# Altium schematic sheet MIDI.SchDoc
size A4; DocumentNumber: 3; SheetNumber: 3
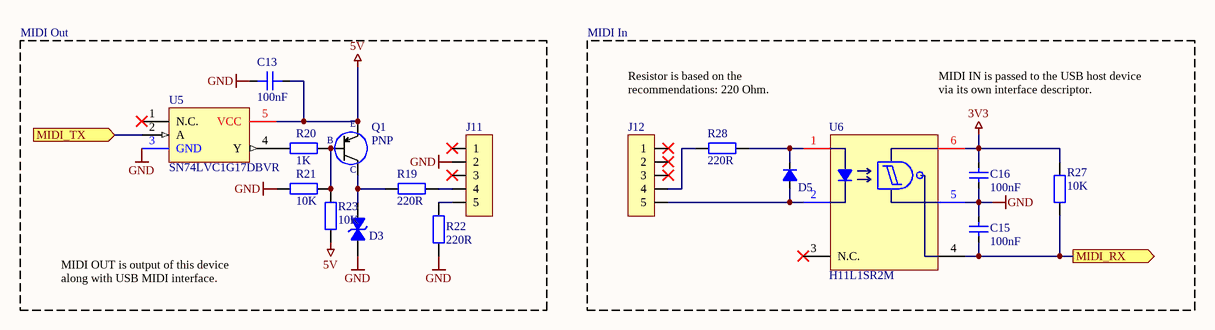
[diagram p0: MIDI.SchDoc]

## Parts
C13  100nF  [0603C_RF_M]
C15  100nF  [0603C_RF_M]
C16  100nF  [0603C_RF_M]
D3  TVS  [NXP_SOD-323_RF_M]  (value not drawn)
D5  D  [NXP_SOD-323_RF_M]  (value not drawn)
J11  PINHDR-5P1  [HEADER-2.54-5P1]  (value not drawn)
J12  PINHDR-5P1  [HEADER-2.54-5P1]  (value not drawn)
Q1  PNP  [SOT-23-3]
R19  220R  [0603R_RF_M]
R20  1K  [0603R_RF_M]
R21  10K  [0603R_RF_M]
R22  220R  [0603R_RF_M]
R23  10K  [0603R_RF_M]
R27  10K  [0603R_RF_M]
R28  220R  [0603R_RF_M]
U5  SN74LVC1G17DBVR  [TI_SOT-23-5]
U6  H11L1SR2M  [H11L1SR2M_SMD-6]

## Blocks framed on the sheet
MIDI Out: C13 D3 J11 Q1 R19-R23 U5
MIDI In: C15 C16 D5 J12 R27 R28 U6

## Ports
MIDI_RX (out), MIDI_TX (in)

## Nets
3V3: C16.2 R27.1 U6.6(VCC)
5V: C13.2 Q1.E(Emmiter) R23.2 U5.5(VCC)
GND: C13.1 C15.2 C16.1 D3.A J11.2 R21.2 R22.1 U5.3(GND) U6.5(GND)
MIDI_RX: C15.1 R27.2 U6.4(OUT) ; port MIDI_RX
MIDI_TX: U5.2(A) ; port MIDI_TX
NetD3_C: D3.C Q1.C(Collector) R19.1
NetD5_A: D5.A J12.5 U6.2(C)
NetD5_C: D5.C R28.2 U6.1(A)
NetJ11_4: J11.4 R19.2
NetJ11_5: J11.5 R22.2
NetJ12_4: J12.4 R28.1
NetQ1_B: Q1.B(Base) R20.1 R21.1 R23.1
NetR20_2: R20.2 U5.4(Y)

Not connected (* = marked no-connect by the designer): J11 1* 3*; J12 1* 2* 3*; U5 1(N.C.)*; U6 3(N.C.)*

## Notes on the sheet
- Resistor is based on the recommendations: 220 Ohm.
- MIDI IN is passed to the USB host device via its own interface descriptor.
- MIDI OUT is output of this device along with USB MIDI interface.
- Author
- Date
- Revision
- Size
- A4
- Sheet
- of

## Library data of the parts
C13 C15 C16 = C: Capacitor; Manufacturer: Generic Brand; Max Voltage: ? V; Value: 100nF; Tolerance: ?; Tag: *; Manufacturer Part No: *; Supplier: *; Supplier Link: http://; Supplier Part No: *; Category: Capacitor; Mounting Technology: SMT
D3 = D-TVS: TVS Diode Bidirectional; Manufacturer: Generic Brand; Power Rating: ? W; Manufacturer Part No: *; Supplier: *; Supplier Link: http://; Supplier Part No: *; Mounting Technology: SMT; Category: Diode
D5 = D: Diode (Rectifier); Manufacturer: Generic Brand; Max Forward Voltage: ? V; Power Rating: ? W; Manufacturer Part No: *; Supplier: *; Supplier Link: http://; Supplier Part No: *; Mounting Technology: SMT; Category: Diode
J11 J12 = PINHDR-5P1: Generic Pin Header 5x1
Q1 = PNP: Bipolar Transistor PNP; pin to pad: B>1 C>3 E>2; Manufacturer: Generic Brand; IGS: ? A; VDS: ? V; Power Rating: ? W; Manufacturer Part No: *; Supplier: *; Supplier Link: http://; Supplier Part No: *; Mounting Technology: SMT; Category: Transistor; VGS: ? V
R19-R23 R27 R28 = R: Resistor; Manufacturer: Generic Brand; Max Voltage: ? V; Power Rating: ? W; Tolerance: ?; Manufacturer Part No: *; Supplier: *; Supplier Link: http://; Supplier Part No: *; Category: Resistor; Mounting Technology: SMT
  R19 R22 R28: Value: 220R
  R20: Value: 1K
  R21 R23 R27: Value: 10K
U5 = SN74LVC1G17DBVR: IC BUF NON-INVERT 5.5V SOT23-5; Manufacturer: Texas Instruments; Supplier Part No: 296-11933-1-ND; Supplier URL: https://www.digikey.com/en/products/detail/texas-instruments/SN74LVC1G17DBVR/389051; Supplier Unit Price: $0.29; Supplier Packaging: Cut Tape; Manufacturer Product Number: SN74LVC1G17DBVR; Operating Temperature: -40°C ~ 125°C (TA); Mounting Type: SMT; Package: SOT-23-5
U6 = H11L1SR2M: OPTOISO 4.17KV OPN COLL SMD-6; Manufacturer: ON Semiconductor; Supplier URL: https://www.digikey.com/en/products/detail/on-semiconductor/H11L1SR2M/458856; Supplier Part No: H11L1SR2MCT-ND; Manufacturer Part No: H11L1SR2M; Mounting Type: SMT; Package: SMD-6; Supplier: DigiKey; Alternative Supplier: Chipdip; Alternative Supplier Link: https://www.chipdip.by/product/h11l1sr2m; Alternative Supplier Part No: 753715628